# Altium schematic sheet 16.SchDoc
size 513 x 386 mm
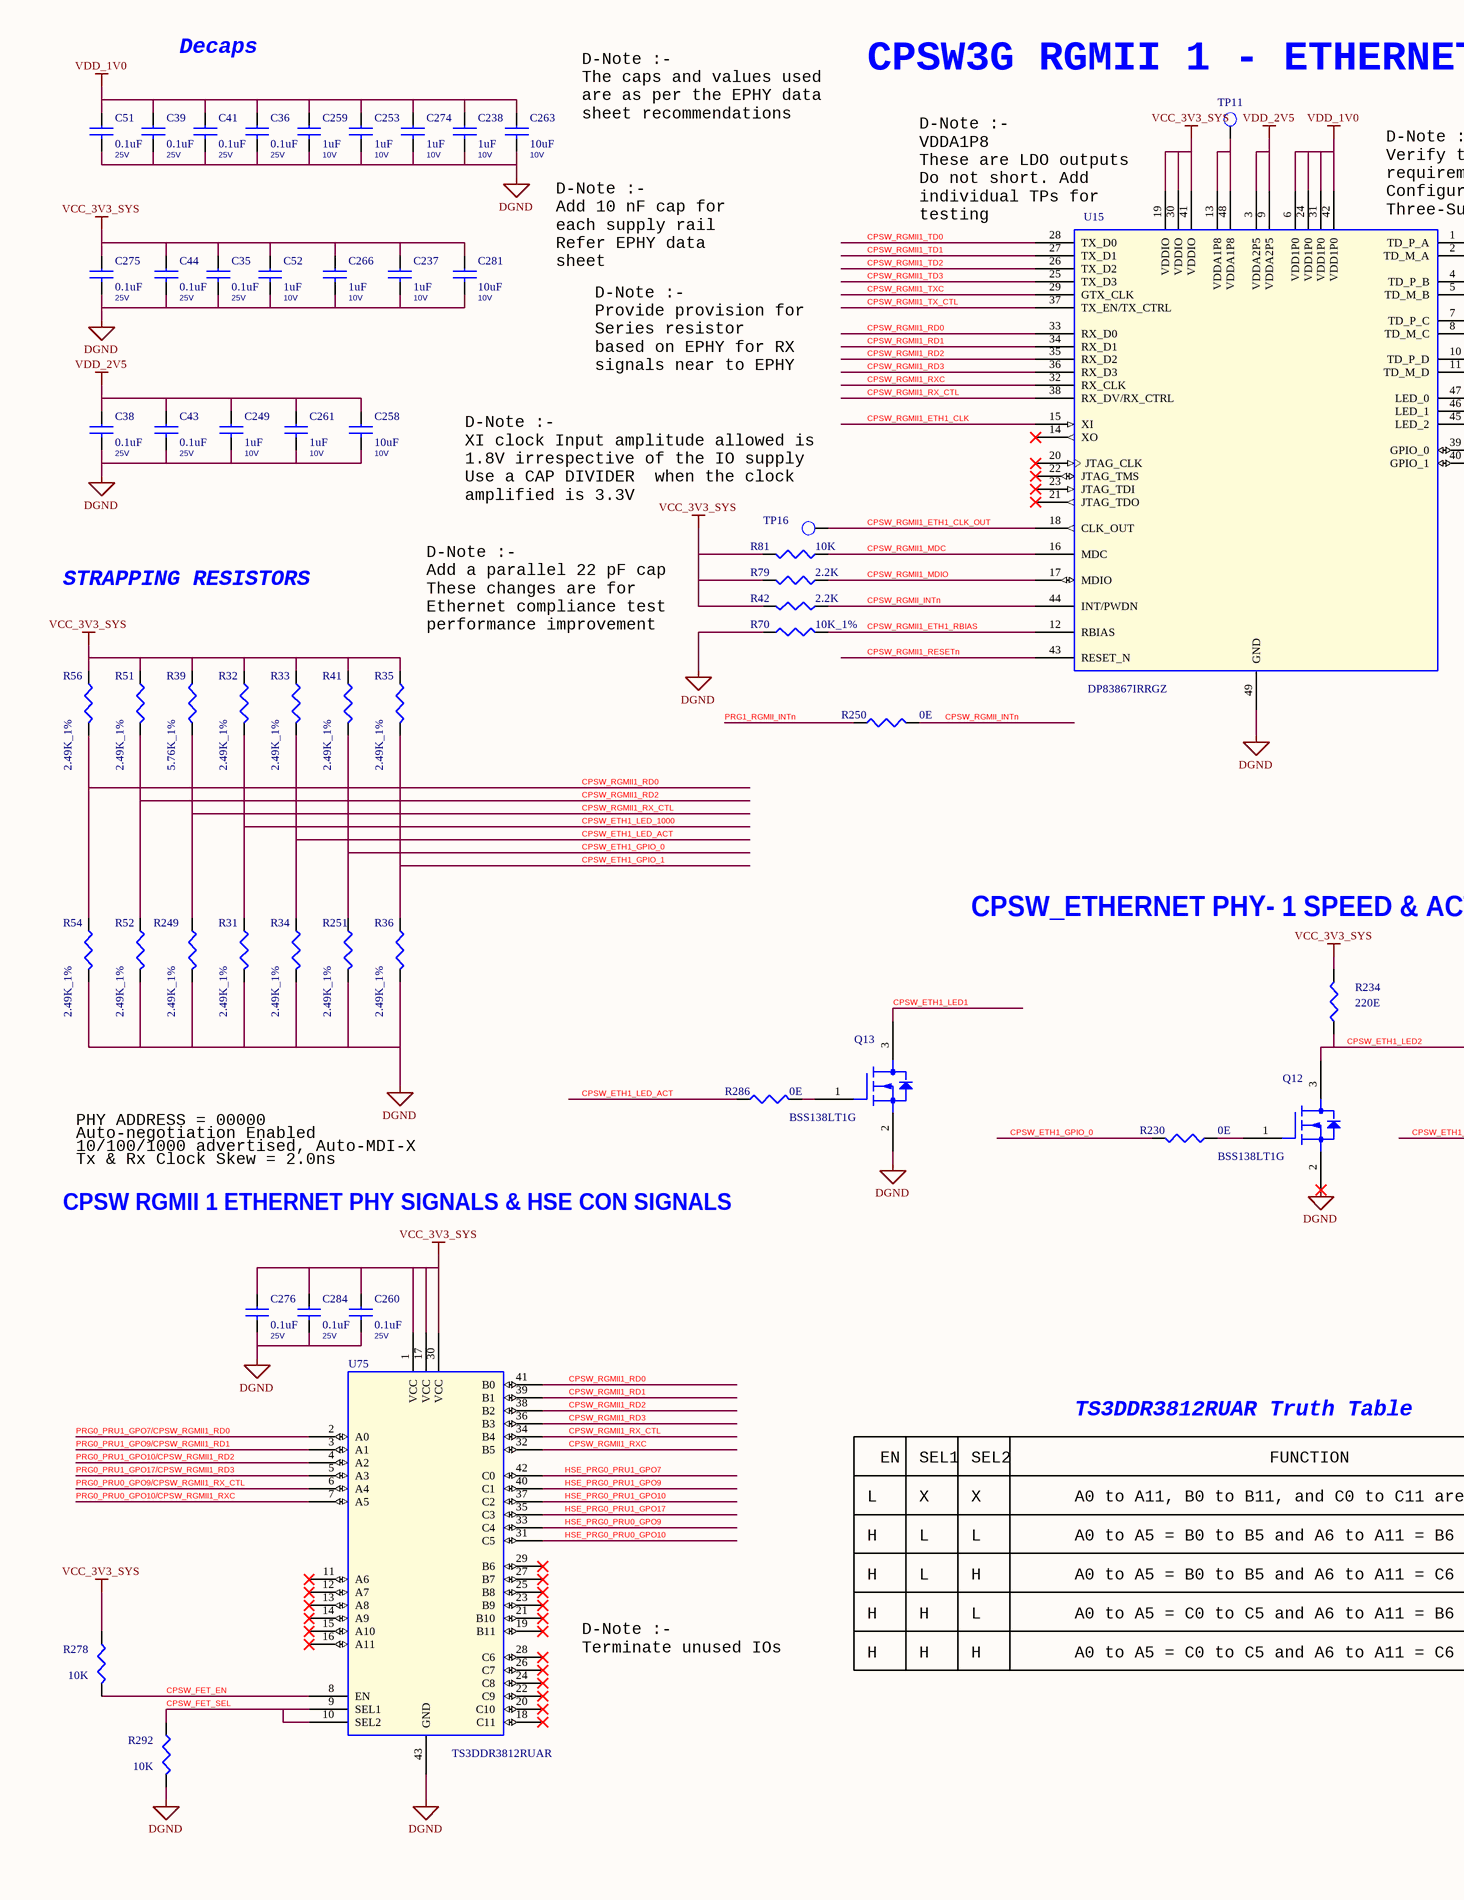
[diagram p0: 16.SchDoc, left]
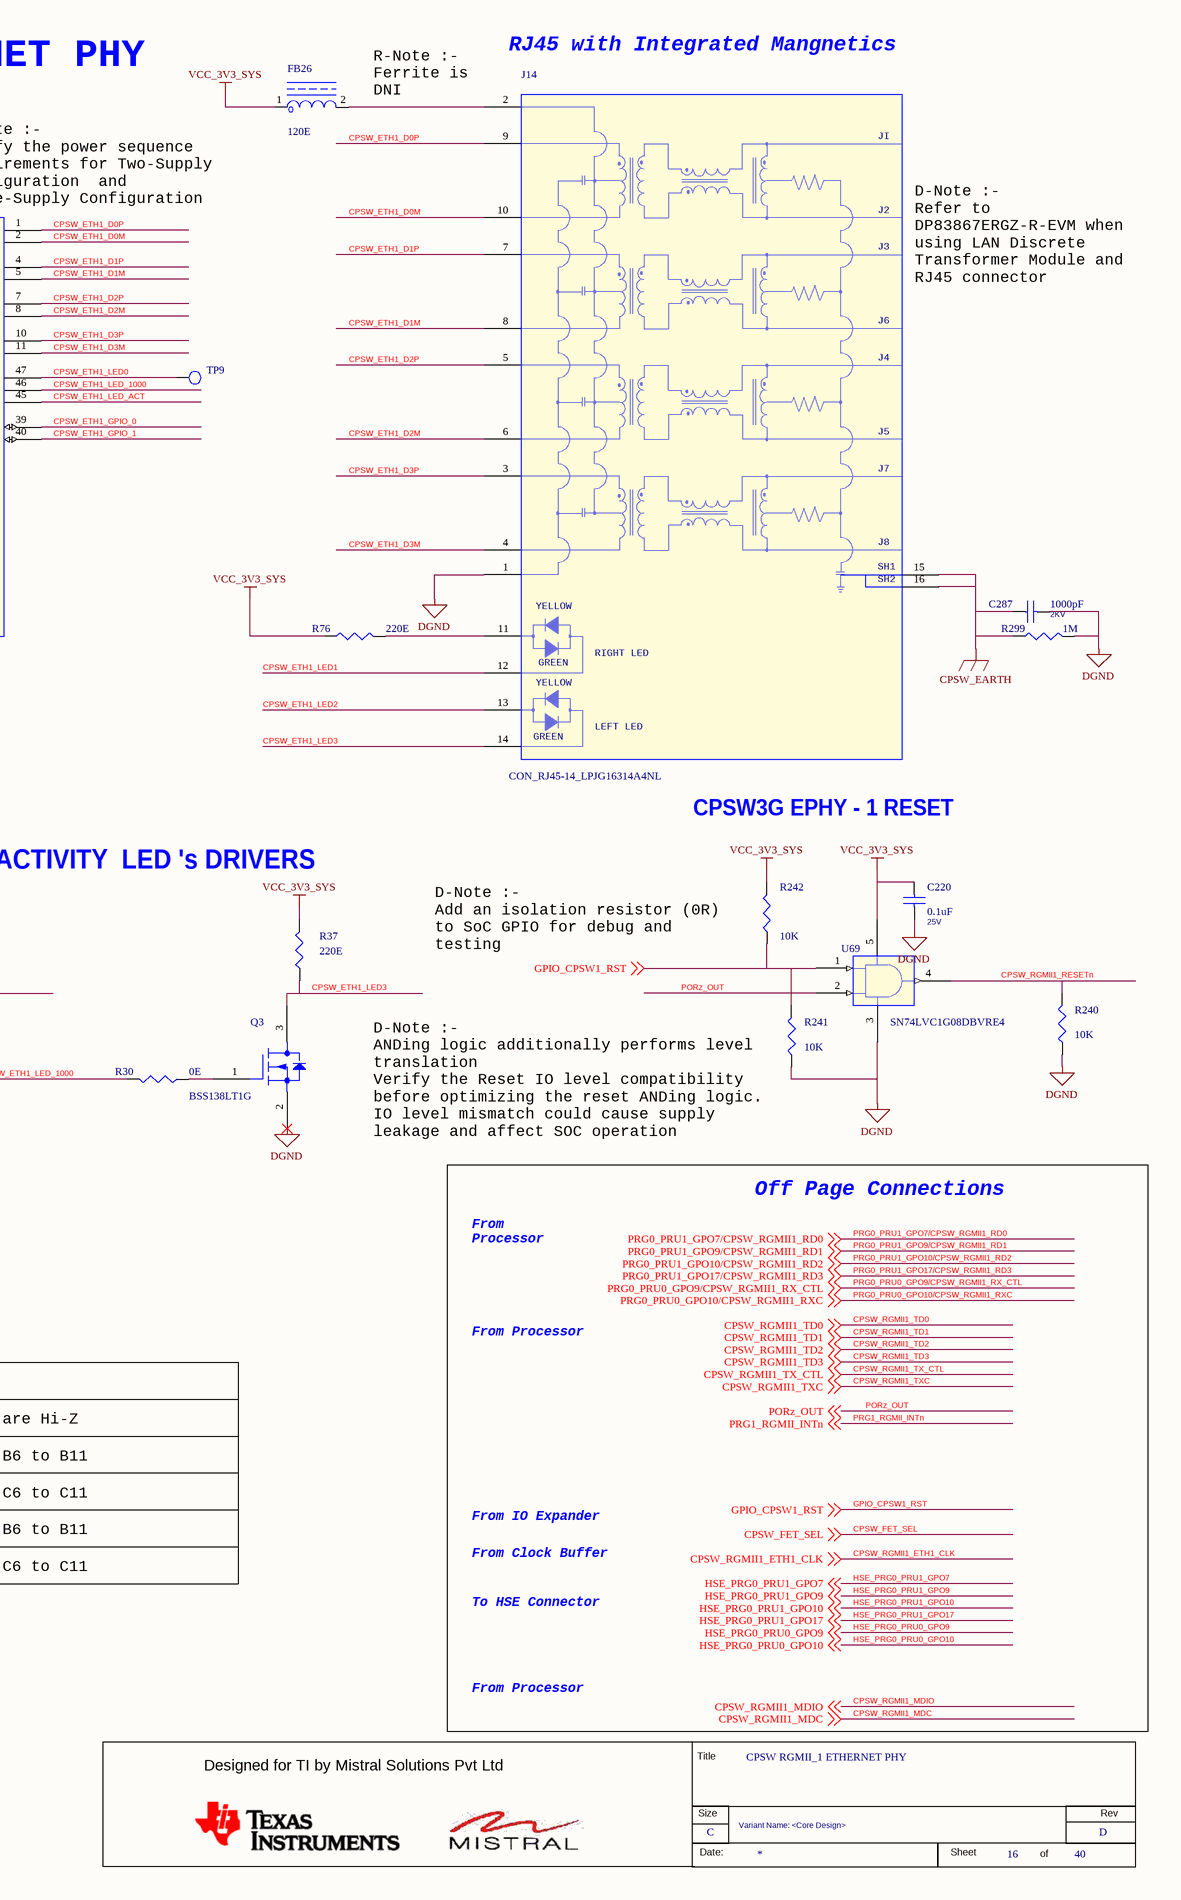
[diagram p1: 16.SchDoc, right]

## Parts
*  RevCode: D  Title: CPSW RGMII_1 ETHERNET PHY  Page Size: C  Page Number: 16  Page Count: 40  Variant Name: <Core Design>  (hidden comment: MISTRAL_TITLEBLK_CSIZE)  (graphical)
C35  0.1uF  Voltage: 25V  [CAP0402_0-75]
C36  0.1uF  Voltage: 25V  [CAP0402_0-75]
C38  0.1uF  Voltage: 25V  [CAP0402_0-75]
C39  0.1uF  Voltage: 25V  [CAP0402_0-75]
C41  0.1uF  Voltage: 25V  [CAP0402_0-75]
C43  0.1uF  Voltage: 25V  [CAP0402_0-75]
C44  0.1uF  Voltage: 25V  [CAP0402_0-75]
C51  0.1uF  Voltage: 25V  [CAP0402_0-75]
C52  1uF  Voltage: 10V  [CAP0402_0-75]
C220  0.1uF  Voltage: 25V  [CAP0402_0-75]
C237  1uF  Voltage: 10V  [CAP0402_0-75]
C238  1uF  Voltage: 10V  [CAP0402_0-75]
C249  1uF  Voltage: 10V  [CAP0402_0-75]
C253  1uF  Voltage: 10V  [CAP0402_0-75]
C258  10uF  Voltage: 10V  [CAP0402_0-75]
C259  1uF  Voltage: 10V  [CAP0402_0-75]
C260  0.1uF  Voltage: 25V  [CAP0402_0-75]
C261  1uF  Voltage: 10V  [CAP0402_0-75]
C263  10uF  Voltage: 10V  [CAP0402_0-75]
C266  1uF  Voltage: 10V  [CAP0402_0-75]
C274  1uF  Voltage: 10V  [CAP0402_0-75]
C275  0.1uF  Voltage: 25V  [CAP0402_0-75]
C276  0.1uF  Voltage: 25V  [CAP0402_0-75]
C281  10uF  Voltage: 10V  [CAP0402_0-75]
C284  0.1uF  Voltage: 25V  [CAP0402_0-75]
C287  1000pF  Voltage: 2KV  [CAP1206_1-75]
FB26  120E  [IND0603_1]
J14  CON_RJ45-14_LPJG16314A4NL  [CON_RJ45-14_LPJG16314A4NL_S_R_T_13-6]
Q3  BSS138LT1G  [SOT23-123_1-2]
Q12  BSS138LT1G  [SOT23-123_1-2]
Q13  BSS138LT1G  [SOT23-123_1-2]
R30  0E  [RES0402_0-5]
R31  2.49K_1%  [RES0402_0-5]
R32  2.49K_1%  [RES0402_0-5]
R33  2.49K_1%  [RES0402_0-5]
R34  2.49K_1%  [RES0402_0-5]
R35  2.49K_1%  [RES0402_0-5]
R36  2.49K_1%  [RES0402_0-5]
R37  220E  [RES0402_0-5]
R39  5.76K_1%  [RES0402_0-5]
R41  2.49K_1%  [RES0402_0-5]
R42  2.2K  [RES0402_0-5]
R51  2.49K_1%  [RES0402_0-5]
R52  2.49K_1%  [RES0402_0-5]
R54  2.49K_1%  [RES0402_0-5]
R56  2.49K_1%  [RES0402_0-5]
R70  10K_1%  [RES0402_0-5]
R76  220E  [RES0402_0-5]
R79  2.2K  [RES0402_0-5]
R81  10K  [RES0402_0-5]
R230  0E  [RES0402_0-5]
R234  220E  [RES0402_0-5]
R240  10K  [RES0402_0-5]
R241  10K  [RES0402_0-5]
R242  10K  [RES0402_0-5]
R249  2.49K_1%  [RES0402_0-5]
R250  0E  [RES0402_0-5]
R251  2.49K_1%  [RES0402_0-5]
R278  10K  [RES0402_0-5]
R286  0E  [RES0402_0-5]
R292  10K  [RES0402_0-5]
R299  1M  [RES0603_0-75]
TP9  TP20_SMD  [TP20_SMD]  (value not drawn)
TP11  TP20_SMD  [TP20_SMD]  (value not drawn)
TP16  TP20_SMD  [TP20_SMD]  (value not drawn)
U15  DP83867IRRGZ  [QFN48_19-68_280X280_1]
U69  SN74LVC1G08DBVRE4  [SOT23-5]
U75  TS3DDR3812RUAR  [TQFN42_19-68_140X360_0-8]

## Nets
CPSW_EARTH: C287.1 J14.15(SH1) J14.16(SH2) R299.1
DGND: C35.2 C36.2 C38.2 C39.2 C41.2 C43.2 C44.2 C51.2 C52.2 C220.2 C237.2 C238.2 C249.2 C253.2 C258.2 C259.2 C260.2 C261.2 C263.2 C266.2 C274.2 C275.2 C276.2 C281.2 C284.2 C287.2 J14.1(CH-GND) Q3.2(S) Q12.2(S) Q13.2(S) R31.2 R34.2 R36.2 R52.2 R54.2 R70.2 R240.2 R241.2 R249.2 R251.2 R292.2 R299.2 U15.49(GND) U69.3(GND) U75.43(GND)
VCC_3V3_SYS: C35.1 C44.1 C52.1 C220.1 C237.1 C260.1 C266.1 C275.1 C276.1 C281.1 C284.1 FB26.1 R32.1 R33.1 R35.1 R37.2 R39.2 R41.1 R42.2 R51.1 R56.1 R76.1 R79.2 R81.1 R234.2 R242.2 R278.1 U15.19(VDDIO) U15.30(VDDIO) U15.41(VDDIO) U69.5(VCC) U75.1(VCC) U75.17(VCC) U75.30(VCC)
VDD_1V0: C36.1 C39.1 C41.1 C51.1 C238.1 C253.1 C259.1 C263.1 C274.1 U15.6(VDD1P0) U15.24(VDD1P0) U15.31(VDD1P0) U15.42(VDD1P0)
VDD_2V5: C38.1 C43.1 C249.1 C258.1 C261.1 U15.3(VDDA2P5) U15.9(VDDA2P5)
CPSW_ETH1_D0M: J14.10(MX0-) U15.2(TD_M_A)
CPSW_ETH1_D0P: J14.9(MX0+) U15.1(TD_P_A)
CPSW_ETH1_D1M: J14.8(MX1-) U15.5(TD_M_B)
CPSW_ETH1_D1P: J14.7(MX1+) U15.4(TD_P_B)
CPSW_ETH1_D2M: J14.6(MX2-) U15.8(TD_M_C)
CPSW_ETH1_D2P: J14.5(MX2+) U15.7(TD_P_C)
CPSW_ETH1_D3M: J14.4(MX3-) U15.11(TD_M_D)
CPSW_ETH1_D3P: J14.3(MX3+) U15.10(TD_P_D)
CPSW_ETH1_GPIO_0: R41.2 R230.2 R251.1 U15.39(GPIO_0)
CPSW_ETH1_GPIO_1: R35.2 R36.1 U15.40(GPIO_1)
CPSW_ETH1_LED0: TP9.1(TP) U15.47(LED_0)
CPSW_ETH1_LED1: J14.12 Q13.3(D)
CPSW_ETH1_LED2: J14.13 Q12.3(D) R234.1
CPSW_ETH1_LED3: J14.14 Q3.3(D) R37.1
CPSW_ETH1_LED_1000: R30.2 R31.1 R32.2 U15.46(LED_1)
CPSW_ETH1_LED_ACT: R33.2 R34.1 R286.1 U15.45(LED_2)
CPSW_FET_EN: R278.2 U75.8(EN)
CPSW_FET_SEL: R292.1 U75.9(SEL1) U75.10(SEL2) ; off-sheet CPSW_FET_SEL
CPSW_RGMII1_ETH1_CLK: U15.15(XI) ; off-sheet CPSW_RGMII1_ETH1_CLK
CPSW_RGMII1_ETH1_CLK_OUT: TP16.1(TP) U15.18(CLK_OUT)
CPSW_RGMII1_ETH1_RBIAS: R70.1 U15.12(RBIAS)
CPSW_RGMII1_MDC: R81.2 U15.16(MDC) ; off-sheet CPSW_RGMII1_MDC
CPSW_RGMII1_MDIO: R79.1 U15.17(MDIO) ; off-sheet CPSW_RGMII1_MDIO
CPSW_RGMII1_RD0: R54.1 R56.2 U15.33(RX_D0) U75.41(B0)
CPSW_RGMII1_RD1: U15.34(RX_D1) U75.39(B1)
CPSW_RGMII1_RD2: R51.2 R52.1 U15.35(RX_D2) U75.38(B2)
CPSW_RGMII1_RD3: U15.36(RX_D3) U75.36(B3)
CPSW_RGMII1_RESETn: R240.1 U15.43(RESET_N) U69.4(Y)
CPSW_RGMII1_RX_CTL: R39.1 R249.1 U15.38(RX_DV/RX_CTRL) U75.34(B4)
CPSW_RGMII1_RXC: U15.32(RX_CLK) U75.32(B5)
CPSW_RGMII1_TD0: U15.28(TX_D0) ; off-sheet CPSW_RGMII1_TD0
CPSW_RGMII1_TD1: U15.27(TX_D1) ; off-sheet CPSW_RGMII1_TD1
CPSW_RGMII1_TD2: U15.26(TX_D2) ; off-sheet CPSW_RGMII1_TD2
CPSW_RGMII1_TD3: U15.25(TX_D3) ; off-sheet CPSW_RGMII1_TD3
CPSW_RGMII1_TX_CTL: U15.37(TX_EN/TX_CTRL) ; off-sheet CPSW_RGMII1_TX_CTL
CPSW_RGMII1_TXC: U15.29(GTX_CLK) ; off-sheet CPSW_RGMII1_TXC
CPSW_RGMII_INTn: R42.1 R250.2 U15.44(INT/PWDN)
GPIO_CPSW1_RST: R241.1 R242.1 U69.1(A) ; off-sheet GPIO_CPSW1_RST
HSE_PRG0_PRU0_GPO9: U75.33(C4) ; off-sheet HSE_PRG0_PRU0_GPO9
HSE_PRG0_PRU0_GPO10: U75.31(C5) ; off-sheet HSE_PRG0_PRU0_GPO10
HSE_PRG0_PRU1_GPO7: U75.42(C0) ; off-sheet HSE_PRG0_PRU1_GPO7
HSE_PRG0_PRU1_GPO9: U75.40(C1) ; off-sheet HSE_PRG0_PRU1_GPO9
HSE_PRG0_PRU1_GPO10: U75.37(C2) ; off-sheet HSE_PRG0_PRU1_GPO10
HSE_PRG0_PRU1_GPO17: U75.35(C3) ; off-sheet HSE_PRG0_PRU1_GPO17
PORz_OUT: U69.2(B) ; off-sheet PORz_OUT
PRG0_PRU0_GPO9/CPSW_RGMII1_RX_CTL: U75.6(A4) ; off-sheet PRG0_PRU0_GPO9/CPSW_RGMII1_RX_CTL
PRG0_PRU0_GPO10/CPSW_RGMII1_RXC: U75.7(A5) ; off-sheet PRG0_PRU0_GPO10/CPSW_RGMII1_RXC
PRG0_PRU1_GPO7/CPSW_RGMII1_RD0: U75.2(A0) ; off-sheet PRG0_PRU1_GPO7/CPSW_RGMII1_RD0
PRG0_PRU1_GPO9/CPSW_RGMII1_RD1: U75.3(A1) ; off-sheet PRG0_PRU1_GPO9/CPSW_RGMII1_RD1
PRG0_PRU1_GPO10/CPSW_RGMII1_RD2: U75.4(A2) ; off-sheet PRG0_PRU1_GPO10/CPSW_RGMII1_RD2
PRG0_PRU1_GPO17/CPSW_RGMII1_RD3: U75.5(A3) ; off-sheet PRG0_PRU1_GPO17/CPSW_RGMII1_RD3
PRG1_RGMII_INTn: R250.1 ; off-sheet PRG1_RGMII_INTn
NetFB26_2: FB26.2 J14.2(VCC)
NetJ14_11: J14.11 R76.2
NetQ3_1: Q3.1(G) R30.1
NetQ12_1: Q12.1(G) R230.1
NetQ13_1: Q13.1(G) R286.2
NetTP11_1: TP11.1(TP) U15.13(VDDA1P8) U15.48(VDDA1P8)

Not connected (* = marked no-connect by the designer): U15 14(XO)* 20(JTAG_CLK)* 21(JTAG_TDO)* 22(JTAG_TMS)* 23(JTAG_TDI)*; U75 11(A6)* 12(A7)* 13(A8)* 14(A9)* 15(A10)* 16(A11)* 18(C11)* 19(B11)* 20(C10)* 21(B10)* 22(C9)* 23(B9)* 24(C8)* 25(B8)* 26(C7)* 27(B7)* 28(C6)* 29(B6)*

## Notes on the sheet
- Decaps
- D-Note :-
  The caps and values used
  are as per the EPHY data
  sheet recommendations
- R-Note :-
  Ferrite is
  DNI
- RJ45 with Integrated Mangnetics
- (near TP11) CPSW3G RGMII 1 - ETHERNET PHY
- (near U15) D-Note :-
  VDDA1P8
  These are LDO outputs
  Do not short. Add
  individual TPs for
  testing
- (near U15) D-Note :-
  Verify the power sequence
  requirements for Two-Supply
  Configuration  and
  Three-Supply Configuration
- D-Note :-
  Add 10 nF cap for
  each supply rail
  Refer EPHY data
  sheet
- (near J14) D-Note :-
  Refer to
  DP83867ERGZ-R-EVM when
  using LAN Discrete
  Transformer Module and
  RJ45 connector
- D-Note :-
  Provide provision for
  Series resistor
  based on EPHY for RX
  signals near to EPHY
- (near TP16) D-Note :-
  XI clock Input amplitude allowed is
  1.8V irrespective of the IO supply
  Use a CAP DIVIDER  when the clock
  amplified is 3.3V
- D-Note :-
  Add a parallel 22 pF cap
  These changes are for
  Ethernet compliance test
  performance improvement
- STRAPPING RESISTORS
- CPSW3G EPHY - 1 RESET
- CPSW_ETHERNET PHY- 1 SPEED & ACTIVITY  LED 's DRIVERS
- (near R242) D-Note :-
  Add an isolation resistor (0R)
  to SoC GPIO for debug and
  testing
- (near R241) D-Note :-
  ANDing logic additionally performs level
  translation
  Verify the Reset IO level compatibility
  before optimizing the reset ANDing logic.
  IO level mismatch could cause supply
  leakage and affect SOC operation
- PHY ADDRESS = 00000
- 10/100/1000 advertised, Auto-MDI-X
- Auto-negotiation Enabled
- Tx & Rx Clock Skew = 2.0ns
- CPSW RGMII 1 ETHERNET PHY SIGNALS & HSE CON SIGNALS
- From
  Processor
- Off Page Connections
- TS3DDR3812RUAR Truth Table
- From Processor
- EN
- SEL1
- SEL2
- FUNCTION
- H
- L
- X
- A0 to A11, B0 to B11, and C0 to C11 are Hi-Z
- A0 to A5 = B0 to B5 and A6 to A11 = B6 to B11
- D-Note :-
  Terminate unused IOs
- A0 to A5 = B0 to B5 and A6 to A11 = C6 to C11
- A0 to A5 = C0 to C5 and A6 to A11 = B6 to B11
- From IO Expander
- A0 to A5 = C0 to C5 and A6 to A11 = C6 to C11
- From Clock Buffer
- To HSE Connector
- (in symbol CON_RJ45-14_LPJG16314A4NL) JI; J2; J3; J6; J4; J5; J7; J8; YELLOW; RIGHT LED; GREEN; LEFT LED
- (in symbol MISTRAL_TITLEBLK_CSIZE) Title; Designed for TI by Mistral Solutions Pvt Ltd; Size; Rev; Date:; Sheet; of

## Library data of the parts
* = MISTRAL_TITLEBLK_CSIZE: Issue: 1.0; Page Create Date: March  8, 1995; Page Modify Date: *
C35 C36 C38 C39 C41 C43 C44 C51 C275 C284 = CAP_Dup3: CAP CERAMIC 0.1uF 25V 20% X5R 0402; Alt_Mfr_part_number: CC0402KRX5R8BB104; Mistral Part No: 120020080003-R; Mfr_name: WURTH ELECTRONICS; Mfr_part_number: 885012105018; Part_type: CAPACITORS\CERAMIC; Alt_Mfr_name: YAGEO AMERICA; Project: AM64x_EVM_BRD; Wattage: NA; Customs_HS_Code: 85322990; Custom_Duty: 15%; Tolerance: 20%; Package: 0402; Distributor_name: DIGIKEY; Distributor_part_number: 732-7495-1-ND; Height: 0.55MM; Weight: 0.65mg; Temperature: -55癈+85癈; Datasheet: Y:\MIS_DATABASE\DATASHEETS\CAPACITORS\885012105018.PDF; Crtd /date: ALVY/170820; Chkd/date: MANIRAJA/170820; MECHANICAL 3D STEP FILE: CAP0402_0-75; Library Ref: CAP; Footprint Ref: CAP0402_0-75; Library Path: Y:\MIS_DATABASE\Library\ALTIUM_TOOL\SCHEMATICS_PARTS\MS_DISCRETE_Library.schlib; Footprint Path: Y:\MIS_DATABASE\Library\ALTIUM_TOOL\PCB_FOOTPRINTS\Altium_Footprint_Lib.PcbLib; PCB Footprint: CAP0402_0-75
C52 C249 C259 C261 C266 C274 = CAP_Dup3: CAP CERAMIC 1uF 10V 20% X5R 0402; Part_type: CAPACITORS\CERAMIC; Mfr_part_number: 885012105012; Mfr_name: WURTH ELECTRONICS; Mistral Part No: 120020080009-R; Custom_Duty: 15%; Customs_HS_Code: 85322990; Wattage: NA; Project: AM64x_EVM_BRD; Chkd/date: MANIRAJA/210820; Crtd /date: ALVY/190820; Datasheet: Y:\MIS_DATABASE\DATASHEETS\CAPACITORS\885012105012.PDF; Temperature: -55癈+85癈; Weight: 0.65mg; Height: 0.55MM; Distributor_part_number: 732-7489-1-ND; Distributor_name: DIGIKEY; Package: 0402; Tolerance: 20%; MECHANICAL 3D STEP FILE: CAP0402_0-75; Library Path: Y:\MIS_DATABASE\Library\ALTIUM_TOOL\SCHEMATICS_PARTS\MS_DISCRETE_Library.schlib; Footprint Path: Y:\MIS_DATABASE\Library\ALTIUM_TOOL\PCB_FOOTPRINTS\Altium_Footprint_Lib.PcbLib; Library Ref: CAP; Footprint Ref: CAP0402_0-75; PCB Footprint: CAP0402_0-75
C220 C260 C276 = CAP_Dup3: CAP CERAMIC 0.1uF 25V 20% X5R 0402; Alt_Mfr_name: YAGEO AMERICA; Part_type: CAPACITORS\CERAMIC; Mfr_part_number: 885012105018; Mfr_name: WURTH ELECTRONICS; Mistral Part No: 120020080003-R; Alt_Mfr_part_number: CC0402KRX5R8BB104; Custom_Duty: 15%; Customs_HS_Code: 85322990; Wattage: NA; Project: AM64x_EVM_BRD; Footprint Path: Y:\MIS_DATABASE\Library\ALTIUM_TOOL\PCB_FOOTPRINTS\Altium_Footprint_Lib.PcbLib; Library Path: Y:\MIS_DATABASE\Library\ALTIUM_TOOL\SCHEMATICS_PARTS\MS_DISCRETE_Library.schlib; Footprint Ref: CAP0402_0-75; Library Ref: CAP; MECHANICAL 3D STEP FILE: CAP0402_0-75; Chkd/date: MANIRAJA/170820; Crtd /date: ALVY/170820; Datasheet: Y:\MIS_DATABASE\DATASHEETS\CAPACITORS\885012105018.PDF; Temperature: -55癈+85癈; Weight: 0.65mg; Height: 0.55MM; Distributor_part_number: 732-7495-1-ND; Distributor_name: DIGIKEY; Package: 0402; Tolerance: 20%; PCB Footprint: CAP0402_0-75
C237 C238 C253 = CAP_Dup3: CAP CERAMIC 1uF 10V 20% X5R 0402; Mistral Part No: 120020080009-R; Mfr_name: WURTH ELECTRONICS; Mfr_part_number: 885012105012; Part_type: CAPACITORS\CERAMIC; Project: AM64x_EVM_BRD; Wattage: NA; Customs_HS_Code: 85322990; Custom_Duty: 15%; Footprint Ref: CAP0402_0-75; Library Ref: CAP; Footprint Path: Y:\MIS_DATABASE\Library\ALTIUM_TOOL\PCB_FOOTPRINTS\Altium_Footprint_Lib.PcbLib; Library Path: Y:\MIS_DATABASE\Library\ALTIUM_TOOL\SCHEMATICS_PARTS\MS_DISCRETE_Library.schlib; MECHANICAL 3D STEP FILE: CAP0402_0-75; Tolerance: 20%; Package: 0402; Distributor_name: DIGIKEY; Distributor_part_number: 732-7489-1-ND; Height: 0.55MM; Weight: 0.65mg; Temperature: -55癈+85癈; Datasheet: Y:\MIS_DATABASE\DATASHEETS\CAPACITORS\885012105012.PDF; Crtd /date: ALVY/190820; Chkd/date: MANIRAJA/210820; PCB Footprint: CAP0402_0-75
C258 = CAP_Dup3: CAP CERAMIC 10uF 10V 20% X5R 0402; Part_type: CAPACITORS\CERAMIC; Mfr_part_number: GRM155R61A106ME11D; Mfr_name: MURATA; Mistral Part No: 120013110019-R; Wattage: NA; Custom_Duty: 15%; Customs_HS_Code: 85322990; Project: QCS610_NANOSOM; Library Ref: CAP; MECHANICAL 3D STEP FILE: CAP0402_0-75; Temperature: -55癈+85癈; Weight: 3.1mg; Chkd/date: MANIRAJA/300520; Crtd /date: ALVY/260520; Datasheet: Y:\MIS_DATABASE\DATASHEETS\CAPACITORS\MURATA-GXX-SER_NOV17.PDF; Height: 0.55MM; Distributor_part_number: 490-GRM155R61A106ME11DTR-ND; Distributor_name: DIGIKEY; Package: 0402; Tolerance: 20%; Footprint Ref: CAP0402_0-75; Library Path: Y:\MIS_DATABASE\Library\ALTIUM_TOOL\SCHEMATICS_PARTS\MS_DISCRETE_Library.schlib; Footprint Path: Y:\MIS_DATABASE\Library\ALTIUM_TOOL\PCB_FOOTPRINTS\Altium_Footprint_Lib.PcbLib; PCB Footprint: CAP0402_0-75
C263 = CAP_Dup3: CAP CERAMIC 10uF 10V 20% X5R 0402; Mistral Part No: 120013110019-R; Mfr_name: MURATA; Mfr_part_number: GRM155R61A106ME11D; Part_type: CAPACITORS\CERAMIC; Project: QCS610_NANOSOM; Customs_HS_Code: 85322990; Custom_Duty: 15%; Wattage: NA; Library Ref: CAP; Tolerance: 20%; Package: 0402; Distributor_name: DIGIKEY; Distributor_part_number: 490-GRM155R61A106ME11DTR-ND; Height: 0.55MM; Datasheet: Y:\MIS_DATABASE\DATASHEETS\CAPACITORS\MURATA-GXX-SER_NOV17.PDF; Crtd /date: ALVY/260520; Chkd/date: MANIRAJA/300520; Weight: 3.1mg; Temperature: -55癈+85癈; MECHANICAL 3D STEP FILE: CAP0402_0-75; Footprint Ref: CAP0402_0-75; Library Path: Y:\MIS_DATABASE\Library\ALTIUM_TOOL\SCHEMATICS_PARTS\MS_DISCRETE_Library.schlib; Footprint Path: Y:\MIS_DATABASE\Library\ALTIUM_TOOL\PCB_FOOTPRINTS\Altium_Footprint_Lib.PcbLib; PCB Footprint: CAP0402_0-75
C281 = CAP_Dup3: CAP CERAMIC 10uF 10V 20% X5R 0402; Part_type: CAPACITORS\CERAMIC; Mfr_part_number: GRM155R61A106ME11D; Mfr_name: MURATA; Mistral Part No: 120013110019-R; Custom_Duty: 15%; Customs_HS_Code: 85322990; Project: QCS610_NANOSOM; Wattage: NA; Chkd/date: MANIRAJA/300520; Crtd /date: ALVY/260520; Datasheet: Y:\MIS_DATABASE\DATASHEETS\CAPACITORS\MURATA-GXX-SER_NOV17.PDF; Height: 0.55MM; Distributor_part_number: 490-GRM155R61A106ME11DTR-ND; Distributor_name: DIGIKEY; Package: 0402; Tolerance: 20%; Weight: 3.1mg; Temperature: -55癈+85癈; MECHANICAL 3D STEP FILE: CAP0402_0-75; Library Ref: CAP; Footprint Ref: CAP0402_0-75; Library Path: Y:\MIS_DATABASE\Library\ALTIUM_TOOL\SCHEMATICS_PARTS\MS_DISCRETE_Library.schlib; Footprint Path: Y:\MIS_DATABASE\Library\ALTIUM_TOOL\PCB_FOOTPRINTS\Altium_Footprint_Lib.PcbLib; PCB Footprint: CAP0402_0-75
C287 = CAP_Dup3: CAP CERAMIC 1000pF 2KV 10% X7R 1206; Mistral Part No: 120015080006-R; Mfr_name: AVX CORPORATION; Mfr_part_number: 1206GC102KAT1A; Part_type: CAPACITORS\CERAMIC; Project: ADR1B; Customs_HS_Code: 85322990; Custom_Duty: 15%; Wattage: NA; Tolerance: 10%; Package: 1206; Distributor_name: DIGIKEY; Distributor_part_number: 478-2956-1-ND; Height: 1.52MM; Weight: 16.2mg; Temperature: -55癈+125癈; Datasheet: Y:\MIS_DATABASE\DATASHEETS\CAPACITORS\AVX_HV-MLC.PDF; Crtd /date: MAZHAR/281106; Chkd/date: SHREESHAIL/291106; Library Ref: CAP; Footprint Ref: CAP1206_1-75; Library Path: Y:\MIS_DATABASE\Library\ALTIUM_TOOL\SCHEMATICS_PARTS\MS_DISCRETE_Library.schlib; Footprint Path: Y:\MIS_DATABASE\Library\ALTIUM_TOOL\PCB_FOOTPRINTS\Altium_Footprint_Lib.PcbLib; MECHANICAL 3D STEP FILE: CAP1206_1-75; PCB Footprint: CAP1206_1-75
FB26 = INDUCTOR_FERRITE: IND FERRITE BEAD CHIP 120E 2A 0603; Mfr_part_number: 782631141; Mfr_name: WURTH ELECTRONICS; Mistral Part No: 130020080015-R; Custom_Duty: 24%; Customs_HS_Code: 85437099; Wattage: NA; Tolerance: 25%; Project: AM64x_EVM_BRD; PCB Footprint: IND0603_1; Footprint Path: Y:\MIS_DATABASE\Library\ALTIUM_TOOL\PCB_FOOTPRINTS\Altium_Footprint_Lib.PcbLib; Library Path: Y:\MIS_DATABASE\Library\ALTIUM_TOOL\SCHEMATICS_PARTS\MS_FILTER_Library.schlib; MECHANICAL 3D STEP FILE: IND0603_1; Chkd/date: MANIRAJA/180820; Crtd /date: ALVY/180820; Datasheet: Y:\MIS_DATABASE\DATASHEETS\DISCRETES\INDUCTORS\782631141.PDF; Temperature: -55癈+125癈; Weight: NA; Height: 1.00MM; Library Ref: INDUCTOR_FERRITE; Distributor_part_number: 732-782631141CT-ND; Distributor_name: DIGIKEY; Package: 0603; Voltage: NA; Part_type: INDUCTOR; Footprint Ref: IND0603_1
J14 = CON_RJ45-14_LPJG16314A4NL: CON RJ-45 FEMALE 14POS RT TH; Mistral Part No: 150014060029-R; Mfr_name: LINK-PP; Part_type: CONNECTOR\JACK; Project: AEGIS; Tolerance: NA; Customs_HS_Code: 85369090; Custom_Duty: 24%; PCB Footprint: CON_RJ45-14_LPJG16314A4NL_S_R_T_13-6; Footprint Ref: CON_RJ45-14_LPJG16314A4NL_S_R_T_13-6; Mfr_part_number: LPJG16314A4NL; Voltage: NA; Wattage: NA; Package: THRU-HOLE; Distributor_name: NA; Distributor_part_number: NA; Library Ref: CON_RJ45-14_LPJG16314A4NL; Height: 13.60MM; Weight: NA; Temperature: -0癈+70癈; Datasheet: Y:\MIS_DATABASE\DATASHEETS\CONNECTORS\LPJG16314A4NL.PDF; Crtd /date: BALACHANDAR/120614; Chkd/date: VASANTHA/150714; MECHANICAL 3D STEP FILE: CON_RJ45-14_LPJG16314A4NL_S_R_T_13-6; Library Path: Y:\MIS_DATABASE\Library\ALTIUM_TOOL\SCHEMATICS_PARTS\MS_CONNECTOR_Library.schlib; Footprint Path: Y:\MIS_DATABASE\Library\ALTIUM_TOOL\PCB_FOOTPRINTS\Altium_Footprint_Lib.PcbLib
Q3 = MOSFET_BSS138LT1G: IC MOSFET N-CHANNEL 50V 200mA SOT23-3; Mistral Part No: 142016040001-R; Mfr_name: ON SEMICONDUCTOR; Part_type: ICS\POWER\MOSFET; Project: LRDE_ABCM; Tolerance: NA; Customs_HS_Code: 85423100; Custom_Duty: 15%; Footprint Path: Y:\MIS_DATABASE\Library\ALTIUM_TOOL\PCB_FOOTPRINTS\Altium_Footprint_Lib.PcbLib; Library Path: Y:\MIS_DATABASE\Library\ALTIUM_TOOL\SCHEMATICS_PARTS\MS_MOSFET_Library.schlib; MECHANICAL 3D STEP FILE: SOT23-123_1-2; Footprint Ref: SOT23-123_1-2; Library Ref: MOSFET_BSS138W; Mfr_part_number: BSS138LT1G; Voltage: NA; Wattage: NA; Package: SOT23-3; Distributor_name: DIGIKEY; Distributor_part_number: BSS138LT1GOSCT-ND; Height: 1.11MM; Weight: 8mg; Temperature: -55癈+150癈; Datasheet: Y:\MIS_DATABASE\DATASHEETS\DISCRETES\TRANSISTORS_FETS\BSS138LT1G.PDF; Crtd /date: JEBRAN/060416; Chkd/date: MANIRAJA/250219; PCB Footprint: SOT23-123_1-2
Q12 Q13 = MOSFET_BSS138LT1G: IC MOSFET N-CHANNEL 50V 200mA SOT23-3; Part_type: ICS\POWER\MOSFET; Mfr_name: ON SEMICONDUCTOR; Mistral Part No: 142016040001-R; Custom_Duty: 15%; Customs_HS_Code: 85423100; Wattage: NA; Project: LRDE_ABCM; Footprint Path: Y:\MIS_DATABASE\Library\ALTIUM_TOOL\PCB_FOOTPRINTS\Altium_Footprint_Lib.PcbLib; Library Path: Y:\MIS_DATABASE\Library\ALTIUM_TOOL\SCHEMATICS_PARTS\MS_MOSFET_Library.schlib; MECHANICAL 3D STEP FILE: SOT23-123_1-2; Footprint Ref: SOT23-123_1-2; Library Ref: MOSFET_BSS138W; Chkd/date: MANIRAJA/250219; Crtd /date: JEBRAN/060416; Datasheet: Y:\MIS_DATABASE\DATASHEETS\DISCRETES\TRANSISTORS_FETS\BSS138LT1G.PDF; Temperature: -55癈+150癈; Weight: 8mg; Height: 1.11MM; Distributor_part_number: BSS138LT1GOSCT-ND; Distributor_name: DIGIKEY; Package: SOT23-3; Voltage: NA; Tolerance: NA; Mfr_part_number: BSS138LT1G; PCB Footprint: SOT23-123_1-2
R30 = RESISTOR_Dup5: RES 0E 1/16W JUMPER 0402; Mistral Part No: 110010080019-R; Mfr_name: VISHAY; Mfr_part_number: CRCW04020000Z0ED; Part_type: RESISTORS\FIXED; Project: PB_BUGBASE; Tolerance: NA; Customs_HS_Code: 85332119; Custom_Duty: 15%; Footprint Path: Y:\MIS_DATABASE\Library\ALTIUM_TOOL\PCB_FOOTPRINTS\Altium_Footprint_Lib.PcbLib; Library Path: Y:\MIS_DATABASE\Library\ALTIUM_TOOL\SCHEMATICS_PARTS\MS_DISCRETE_Library.schlib; Footprint Ref: RES0402_0-5; Library Ref: RESISTOR; Voltage: NA; Wattage: 1/16W; Package: 0402; Distributor_name: DIGIKEY; Distributor_part_number: 541-0.0JCT-ND; Height: 0.40MM; Weight: 0.65mg; Temperature: -55癈+155癈; Datasheet: Y:\MIS_DATABASE\DATASHEETS\RESISTORS\CRCW0603.PDF; Crtd /date: MUDDU/190810; Chkd/date: VASANTHA/201216; MECHANICAL 3D STEP FILE: RES0402_0-5; PCB Footprint: RES0402_0-5
R31 R34-R36 R41 R51 R54 R251 = RESISTOR_Dup6: RES 2.49K 1/16W 1% 0402; Part_type: RESISTORS\FIXED; Mfr_part_number: RC0402FR-072K49L; Mfr_name: YAGEO AMERICA; Mistral Part No: 110016050020-R; Custom_Duty: 15%; Customs_HS_Code: 85332119; Voltage: NA; Project: TMDXCSKCC; PCB Footprint: RES0402_0-5; Library Ref: RESISTOR; Chkd/date: VASANTHA/270516; Crtd /date: VASANTHA/270516; Datasheet: Y:\MIS_DATABASE\DATASHEETS\RESISTORS\RCXXXXL-SER_MAR18.PDF; Temperature: -55癈+155癈; Weight: 0.65mg; Height: 0.40MM; Distributor_part_number: 311-2.49KLRCT-ND; Distributor_name: DIGIKEY; Package: 0402; Wattage: 1/16W; Tolerance: 1%; Footprint Ref: RES0402_0-5; MECHANICAL 3D STEP FILE: RES0402_0-5; Library Path: Y:\MIS_DATABASE\Library\ALTIUM_TOOL\SCHEMATICS_PARTS\MS_DISCRETE_Library.schlib; Footprint Path: Y:\MIS_DATABASE\Library\ALTIUM_TOOL\PCB_FOOTPRINTS\Altium_Footprint_Lib.PcbLib
R32 R33 R52 R56 R249 = RESISTOR_Dup6: RES 2.49K 1/16W 1% 0402; Mistral Part No: 110016050020-R; Mfr_name: YAGEO AMERICA; Mfr_part_number: RC0402FR-072K49L; Part_type: RESISTORS\FIXED; Project: TMDXCSKCC; Voltage: NA; Customs_HS_Code: 85332119; Custom_Duty: 15%; PCB Footprint: RES0402_0-5; Tolerance: 1%; Wattage: 1/16W; Package: 0402; Distributor_name: DIGIKEY; Distributor_part_number: 311-2.49KLRCT-ND; Height: 0.40MM; Weight: 0.65mg; Temperature: -55癈+155癈; Datasheet: Y:\MIS_DATABASE\DATASHEETS\RESISTORS\RCXXXXL-SER_MAR18.PDF; Crtd /date: VASANTHA/270516; Chkd/date: VASANTHA/270516; Library Ref: RESISTOR; Footprint Ref: RES0402_0-5; MECHANICAL 3D STEP FILE: RES0402_0-5; Library Path: Y:\MIS_DATABASE\Library\ALTIUM_TOOL\SCHEMATICS_PARTS\MS_DISCRETE_Library.schlib; Footprint Path: Y:\MIS_DATABASE\Library\ALTIUM_TOOL\PCB_FOOTPRINTS\Altium_Footprint_Lib.PcbLib
R37 = RESISTOR_Dup6: RES 220E 1/10W 5% 0402; Mistral Part No: 110009030506-R; Mfr_name: PANASONIC-ECG; Mfr_part_number: ERJ-2GEJ221X; Part_type: RESISTORS\FIXED; Voltage: NA; Project: RED EYE; Customs_HS_Code: 85332119; Custom_Duty: 15%; Footprint Ref: RES0402_0-5; Footprint Path: Y:\MIS_DATABASE\Library\ALTIUM_TOOL\PCB_FOOTPRINTS\Altium_Footprint_Lib.PcbLib; Library Path: Y:\MIS_DATABASE\Library\ALTIUM_TOOL\SCHEMATICS_PARTS\MS_DISCRETE_Library.schlib; MECHANICAL 3D STEP FILE: RES0402_0-5; Temperature: -55癈+155癈; Weight: 0.8mg; Library Ref: RESISTOR; Tolerance: 5%; Wattage: 1/10W; Package: 0402; Distributor_name: DIGIKEY; Distributor_part_number: P220JCT-ND; Height: 0.40MM; Datasheet: Y:\MIS_DATABASE\DATASHEETS\RESISTORS\PAN-ERJSER_NOV17.PDF; Crtd /date: GEETHA/260406; Chkd/date: VASANTHA/291216; PCB Footprint: RES0402_0-5
R39 = RESISTOR_Dup6: RES 5.76K 1/10W 1% 0402; Part_type: RESISTORS\FIXED; Mfr_part_number: ERJ-2RKF5761X; Mfr_name: PANASONIC-ECG; Mistral Part No: 110009030945-R; Voltage: NA; Custom_Duty: 15%; Customs_HS_Code: 85332119; Project: CPB; PCB Footprint: RES0402_0-5; MECHANICAL 3D STEP FILE: RES0402_0-5; Temperature: -55癈+155癈; Weight: 0.8mg; Footprint Ref: RES0402_0-5; Chkd/date: MAZHAR/150709; Crtd /date: USMAN/220808; Datasheet: Y:\MIS_DATABASE\DATASHEETS\RESISTORS\PAN-ERJSER_NOV17.PDF; Height: 0.40MM; Distributor_part_number: P5.76KLCT-ND; Distributor_name: DIGIKEY; Package: 0402; Wattage: 1/10W; Tolerance: 1%; Library Ref: RESISTOR; Library Path: Y:\MIS_DATABASE\Library\ALTIUM_TOOL\SCHEMATICS_PARTS\MS_DISCRETE_Library.schlib; Footprint Path: Y:\MIS_DATABASE\Library\ALTIUM_TOOL\PCB_FOOTPRINTS\Altium_Footprint_Lib.PcbLib
R42 = RESISTOR_Dup6: RES 2.2K 1/16W 5% 0402; Part_type: RESISTORS\FIXED; Mfr_part_number: RC0402JR-072K2L; Mfr_name: YAGEO AMERICA; Mistral Part No: 110010120018-R; Custom_Duty: 15%; Customs_HS_Code: 85332119; Voltage: NA; Project: TE4; PCB Footprint: RES0402_0-5; Library Path: Y:\MIS_DATABASE\Library\ALTIUM_TOOL\SCHEMATICS_PARTS\MS_DISCRETE_Library.schlib; Footprint Ref: RES0402_0-5; Footprint Path: Y:\MIS_DATABASE\Library\ALTIUM_TOOL\PCB_FOOTPRINTS\Altium_Footprint_Lib.PcbLib; MECHANICAL 3D STEP FILE: RES0402_0-5; Chkd/date: VASANTHA/061216; Crtd /date: BAVISH/021210; Datasheet: Y:\MIS_DATABASE\DATASHEETS\RESISTORS\RCXXXXL-SER_MAR18.PDF; Temperature: -55癈+155癈; Weight: 0.65mg; Height: 0.40MM; Distributor_part_number: 311-2.2KJRCT-ND; Distributor_name: DIGIKEY; Package: 0402; Wattage: 1/16W; Tolerance: 5%; Library Ref: RESISTOR
R70 = RESISTOR_Dup6: RES 10K 1/10W 1% AUTO 0402; Mistral Part No: 110020100039-R; Mfr_name: VISHAY; Mfr_part_number: MCS0402MC1002FE000; Part_type: RESISTORS\FIXED; Project: MCX_80MHz_ADC_DRIVER; Voltage: NA; Customs_HS_Code: 85332119; Custom_Duty: 15%; PCB Footprint: RES0402_0-5; Library Ref: RESISTOR; Tolerance: 1%; Wattage: 1/10W; Package: 0402; Distributor_name: DIGIKEY; Distributor_part_number: MCS0402-10.0K-MFCT-ND; Height: 0.37MM; Weight: 0.65mg; Temperature: -55癈+175癈; Datasheet: Y:\MIS_DATABASE\DATASHEETS\RESISTORS\MCTXXXXM-SER.PDF; Crtd /date: ALVY/191020; Chkd/date: MANIRAJA/191020; MECHANICAL 3D STEP FILE: RES0402_0-5; Footprint Ref: RES0402_0-5; Library Path: Y:\MIS_DATABASE\Library\ALTIUM_TOOL\SCHEMATICS_PARTS\MS_DISCRETE_Library.schlib; Footprint Path: Y:\MIS_DATABASE\Library\ALTIUM_TOOL\PCB_FOOTPRINTS\Altium_Footprint_Lib.PcbLib
R76 = RESISTOR_Dup6: RES 220E 1/10W 5% 0402; Part_type: RESISTORS\FIXED; Mfr_part_number: ERJ-2GEJ221X; Mfr_name: PANASONIC-ECG; Mistral Part No: 110009030506-R; Custom_Duty: 15%; Customs_HS_Code: 85332119; Project: RED EYE; Voltage: NA; PCB Footprint: RES0402_0-5; Chkd/date: VASANTHA/291216; Crtd /date: GEETHA/260406; Datasheet: Y:\MIS_DATABASE\DATASHEETS\RESISTORS\PAN-ERJSER_NOV17.PDF; Height: 0.40MM; Distributor_part_number: P220JCT-ND; Distributor_name: DIGIKEY; Package: 0402; Wattage: 1/10W; Tolerance: 5%; Library Ref: RESISTOR; Weight: 0.8mg; Temperature: -55癈+155癈; MECHANICAL 3D STEP FILE: RES0402_0-5; Library Path: Y:\MIS_DATABASE\Library\ALTIUM_TOOL\SCHEMATICS_PARTS\MS_DISCRETE_Library.schlib; Footprint Path: Y:\MIS_DATABASE\Library\ALTIUM_TOOL\PCB_FOOTPRINTS\Altium_Footprint_Lib.PcbLib; Footprint Ref: RES0402_0-5
R79 = RESISTOR_Dup6: RES 2.2K 1/16W 5% 0402; Mistral Part No: 110010120018-R; Mfr_name: YAGEO AMERICA; Mfr_part_number: RC0402JR-072K2L; Part_type: RESISTORS\FIXED; Project: TE4; Voltage: NA; Customs_HS_Code: 85332119; Custom_Duty: 15%; PCB Footprint: RES0402_0-5; Library Path: Y:\MIS_DATABASE\Library\ALTIUM_TOOL\SCHEMATICS_PARTS\MS_DISCRETE_Library.schlib; Footprint Ref: RES0402_0-5; Tolerance: 5%; Wattage: 1/16W; Package: 0402; Distributor_name: DIGIKEY; Distributor_part_number: 311-2.2KJRCT-ND; Height: 0.40MM; Weight: 0.65mg; Temperature: -55癈+155癈; Datasheet: Y:\MIS_DATABASE\DATASHEETS\RESISTORS\RCXXXXL-SER_MAR18.PDF; Crtd /date: BAVISH/021210; Chkd/date: VASANTHA/061216; MECHANICAL 3D STEP FILE: RES0402_0-5; Footprint Path: Y:\MIS_DATABASE\Library\ALTIUM_TOOL\PCB_FOOTPRINTS\Altium_Footprint_Lib.PcbLib; Library Ref: RESISTOR
R81 R240 R242 = RESISTOR_Dup6: RES 10K 1/16W 5% 0402; Mistral Part No: 110011060021-R; Mfr_name: YAGEO AMERICA; Mfr_part_number: RC0402JR-0710KL; Part_type: RESISTORS\FIXED; Project: HSE; Voltage: NA; Customs_HS_Code: 85332119; Custom_Duty: 15%; PCB Footprint: RES0402_0-5; Tolerance: 5%; Wattage: 1/16W; Package: 0402; Distributor_name: DIGIKEY; Distributor_part_number: 311-10KJRCT-ND; Height: 0.40MM; Weight: 0.65mg; Temperature: -55癈+155癈; Datasheet: Y:\MIS_DATABASE\DATASHEETS\RESISTORS\RCXXXXL-SER_MAR18.PDF; Crtd /date: MAZHAR/230805; Chkd/date: VASANTHA/061216; MECHANICAL 3D STEP FILE: RES0402_0-5; Library Ref: RESISTOR; Footprint Ref: RES0402_0-5; Library Path: Y:\MIS_DATABASE\Library\ALTIUM_TOOL\SCHEMATICS_PARTS\MS_DISCRETE_Library.schlib; Footprint Path: Y:\MIS_DATABASE\Library\ALTIUM_TOOL\PCB_FOOTPRINTS\Altium_Footprint_Lib.PcbLib
R230 R250 R286 = RESISTOR_Dup5: RES 0E 1/16W JUMPER 0402; Part_type: RESISTORS\FIXED; Mfr_part_number: CRCW04020000Z0ED; Mfr_name: VISHAY; Mistral Part No: 110010080019-R; Custom_Duty: 15%; Customs_HS_Code: 85332119; Voltage: NA; Project: PB_BUGBASE; Footprint Path: Y:\MIS_DATABASE\Library\ALTIUM_TOOL\PCB_FOOTPRINTS\Altium_Footprint_Lib.PcbLib; Library Path: Y:\MIS_DATABASE\Library\ALTIUM_TOOL\SCHEMATICS_PARTS\MS_DISCRETE_Library.schlib; Footprint Ref: RES0402_0-5; Library Ref: RESISTOR; Chkd/date: VASANTHA/201216; Crtd /date: MUDDU/190810; Datasheet: Y:\MIS_DATABASE\DATASHEETS\RESISTORS\CRCW0603.PDF; Temperature: -55癈+155癈; Weight: 0.65mg; Height: 0.40MM; Distributor_part_number: 541-0.0JCT-ND; Distributor_name: DIGIKEY; Package: 0402; Wattage: 1/16W; Tolerance: NA; MECHANICAL 3D STEP FILE: RES0402_0-5; PCB Footprint: RES0402_0-5
R234 = RESISTOR_Dup6: RES 220E 1/10W 5% 0402; Part_type: RESISTORS\FIXED; Mfr_part_number: ERJ-2GEJ221X; Mfr_name: PANASONIC-ECG; Mistral Part No: 110009030506-R; Voltage: NA; Custom_Duty: 15%; Customs_HS_Code: 85332119; Project: RED EYE; Footprint Ref: RES0402_0-5; Footprint Path: Y:\MIS_DATABASE\Library\ALTIUM_TOOL\PCB_FOOTPRINTS\Altium_Footprint_Lib.PcbLib; Library Path: Y:\MIS_DATABASE\Library\ALTIUM_TOOL\SCHEMATICS_PARTS\MS_DISCRETE_Library.schlib; MECHANICAL 3D STEP FILE: RES0402_0-5; Temperature: -55癈+155癈; Weight: 0.8mg; Library Ref: RESISTOR; Chkd/date: VASANTHA/291216; Crtd /date: GEETHA/260406; Datasheet: Y:\MIS_DATABASE\DATASHEETS\RESISTORS\PAN-ERJSER_NOV17.PDF; Height: 0.40MM; Distributor_part_number: P220JCT-ND; Distributor_name: DIGIKEY; Package: 0402; Wattage: 1/10W; Tolerance: 5%; PCB Footprint: RES0402_0-5
R241 R278 R292 = RESISTOR_Dup6: RES 10K 1/16W 5% 0402; Part_type: RESISTORS\FIXED; Mfr_part_number: RC0402JR-0710KL; Mfr_name: YAGEO AMERICA; Mistral Part No: 110011060021-R; Custom_Duty: 15%; Customs_HS_Code: 85332119; Voltage: NA; Project: HSE; Footprint Path: Y:\MIS_DATABASE\Library\ALTIUM_TOOL\PCB_FOOTPRINTS\Altium_Footprint_Lib.PcbLib; Library Path: Y:\MIS_DATABASE\Library\ALTIUM_TOOL\SCHEMATICS_PARTS\MS_DISCRETE_Library.schlib; Footprint Ref: RES0402_0-5; Library Ref: RESISTOR; MECHANICAL 3D STEP FILE: RES0402_0-5; Chkd/date: VASANTHA/061216; Crtd /date: MAZHAR/230805; Datasheet: Y:\MIS_DATABASE\DATASHEETS\RESISTORS\RCXXXXL-SER_MAR18.PDF; Temperature: -55癈+155癈; Weight: 0.65mg; Height: 0.40MM; Distributor_part_number: 311-10KJRCT-ND; Distributor_name: DIGIKEY; Package: 0402; Wattage: 1/16W; Tolerance: 5%; PCB Footprint: RES0402_0-5
R299 = RESISTOR_Dup6: RES 1M 1/10W 5% 0603; Part_type: RESISTORS\FIXED; Mfr_part_number: ERJ-3GEYJ105V; Mfr_name: PANASONIC-ECG; Mistral Part No: 110009030413-R; Custom_Duty: 15%; Customs_HS_Code: 85332119; Voltage: NA; Project: BSN; PCB Footprint: RES0603_0-75; MECHANICAL 3D STEP FILE: RES0603_0-75; Chkd/date: VASANTHA/060217; Crtd /date: USMAN/111207; Datasheet: Y:\MIS_DATABASE\DATASHEETS\RESISTORS\PAN-ERJSER_NOV17.PDF; Temperature: -55癈+155癈; Weight: 2mg; Height: 0.55MM; Distributor_part_number: P1.0MGCT-ND; Distributor_name: DIGIKEY; Package: 0603; Wattage: 1/10W; Tolerance: 5%; Library Ref: RESISTOR; Footprint Ref: RES0603_0-75; Library Path: Y:\MIS_DATABASE\Library\ALTIUM_TOOL\SCHEMATICS_PARTS\MS_DISCRETE_Library.schlib; Footprint Path: Y:\MIS_DATABASE\Library\ALTIUM_TOOL\PCB_FOOTPRINTS\Altium_Footprint_Lib.PcbLib
TP9 = TESTPOINT: TESTPOINT CIR 20 SMD; Mfr_name: LOCAL; Mistral Part No: NA; Project: BT MODULE_CSRBC04; PCB Footprint: TP20_SMD; RoHS: NA; Footprint Ref: TP20_SMD; Library Ref: TESTPOINT; Chkd/date: SHREESHAIL/171006; Crtd /date: MAZHAR/171006; Height: NA; Distributor_part_number: NA; Distributor_name: NA; Package: SMD; Part_type: TESTPOINT; Mfr_part_number: TP20_SMD; Tolerance: NA; Voltage: NA; Wattage: NA; Weight: NA; Temperature: NA; Datasheet: NA; MECHANICAL 3D STEP FILE: NA; Library Path: Y:\MIS_DATABASE\Library\ALTIUM_TOOL\SCHEMATICS_PARTS\MS_DISCRETE_Library.schlib; Footprint Path: Y:\MIS_DATABASE\Library\ALTIUM_TOOL\PCB_FOOTPRINTS\Altium_Footprint_Lib.PcbLib; Customs_HS_Code: NA; Custom_Duty: NA
TP11 TP16 = TESTPOINT: TESTPOINT CIR 20 SMD; Mfr_name: LOCAL; Custom_Duty: NA; Project: BT MODULE_CSRBC04; PCB Footprint: TP20_SMD; Customs_HS_Code: NA; RoHS: NA; Footprint Ref: TP20_SMD; Library Ref: TESTPOINT; Footprint Path: Y:\MIS_DATABASE\Library\ALTIUM_TOOL\PCB_FOOTPRINTS\Altium_Footprint_Lib.PcbLib; Library Path: Y:\MIS_DATABASE\Library\ALTIUM_TOOL\SCHEMATICS_PARTS\MS_DISCRETE_Library.schlib; MECHANICAL 3D STEP FILE: NA; Datasheet: NA; Temperature: NA; Weight: NA; Wattage: NA; Voltage: NA; Tolerance: NA; Chkd/date: SHREESHAIL/171006; Crtd /date: MAZHAR/171006; Height: NA; Distributor_part_number: NA; Distributor_name: NA; Package: SMD; Part_type: TESTPOINT; Mfr_part_number: TP20_SMD; Mistral Part No: NA
U15 = DP83867IRRGZ_VQFN48: IC HIGH IMMUNITY 10/100/1000 Mb/s ETHERNET PHY LAYER TRANSCEIVER VQFN48; Mistral Part No: 143017080002-R; Mfr_name: TEXAS INSTRUMENTS; Part_type: ICS\TELECOM\TRANSCEIVER; Project: TI_SVB_CONTROLLER CARD; Tolerance: NA; Customs_HS_Code: 85423100; Custom_Duty: 15%; PCB Footprint: QFN48_19-68_280X280_1; Library Ref: DP83867IRRGZ_VQFN48; Mfr_part_number: DP83867IRRGZ; Voltage: NA; Wattage: NA; Package: VQFN48; Distributor_name: DIGIKEY; Distributor_part_number: DP83867IRRGZT-ND; Height: 1.00MM; Weight: NA; Temperature: -40癈+85癈; Datasheet: Y:\MIS_DATABASE\DATASHEETS\ICS\DIGITAL\BUSTRANSCEIVER\DP83867I.PDF; Crtd /date: MANIRAJA/110817; Chkd/date: MANIRAJA/110817; MECHANICAL 3D STEP FILE: QFN48_19-68_280X280_1
U69 = SN74LVC1G08DBVRE4_SOT23-5: IC SINGLE 2-INPUT POSITIVE AND GATE SOT23-5; Mistral Part No: 141009060026-R; Mfr_name: TEXAS INSTRUMENTS; Part_type: ICS\DIGITAL\GATES; Project: KHAN_MAIN; Customs_HS_Code: 85423100; Custom_Duty: 15%; Mfr_part_number: SN74LVC1G08DBVRE4; Package: SOT23-5; Distributor_name: DIGIKEY; Distributor_part_number: SN74LVC1G08DBVRE4-ND; Library Ref: SN74LVC1G08DBVRE4_SOT23-5; Height: 1.45MM; Temperature: -40癈+85癈; Datasheet: Y:\MIS_DATABASE\DATASHEETS\ICS\DIGITAL\GATES\SN74LVC1G08.PDF; Crtd /date: USMAN/151008; Chkd/date: SUHAS/221010; RoHS: Sb/ Br FREE; PCB Footprint: SOT23-5
U75 = TS3DDR3812RUAR_WQFN42: IC 12-CH 1:2 MUX/DEMUX SWITCH FOR DDR3 APPLICATION WQFN42; Mistral Part No: 141018090023-R; Mfr_name: TEXAS INSTRUMENTS; Part_type: ICS\DIGITAL\COMBINATIONAL; Project: TI_J7ES_EVM_CP; Tolerance: NA; Customs_HS_Code: 85423100; Custom_Duty: 15%; Footprint Ref: TQFN42_19-68_140X360_0-8; Mfr_part_number: TS3DDR3812RUAR; Voltage: NA; Wattage: NA; Package: WQFN42; Distributor_name: DIGIKEY; Distributor_part_number: 296-28307-1-ND; Library Ref: TS3DDR3812RUAR_WQFN42; Height: 0.80MM; Weight: 54.8mg; Temperature: -40癈+85癈; Datasheet: Y:\MIS_DATABASE\DATASHEETS\ICS\DIGITAL\COMBINATIONAL\TS3DDR3812.PDF; Crtd /date: ALVY/250918; Chkd/date: MANIRAJA/250918; MECHANICAL 3D STEP FILE: TQFN42_19-68_140X360_0-8; Library Path: Y:\MIS_DATABASE\Library\ALTIUM_TOOL\SCHEMATICS_PARTS\MS_COMBINATIONAL_Library.schlib; Footprint Path: Y:\MIS_DATABASE\Library\ALTIUM_TOOL\PCB_FOOTPRINTS\Altium_Footprint_Lib.PcbLib; PCB Footprint: TQFN42_19-68_140X360_0-8